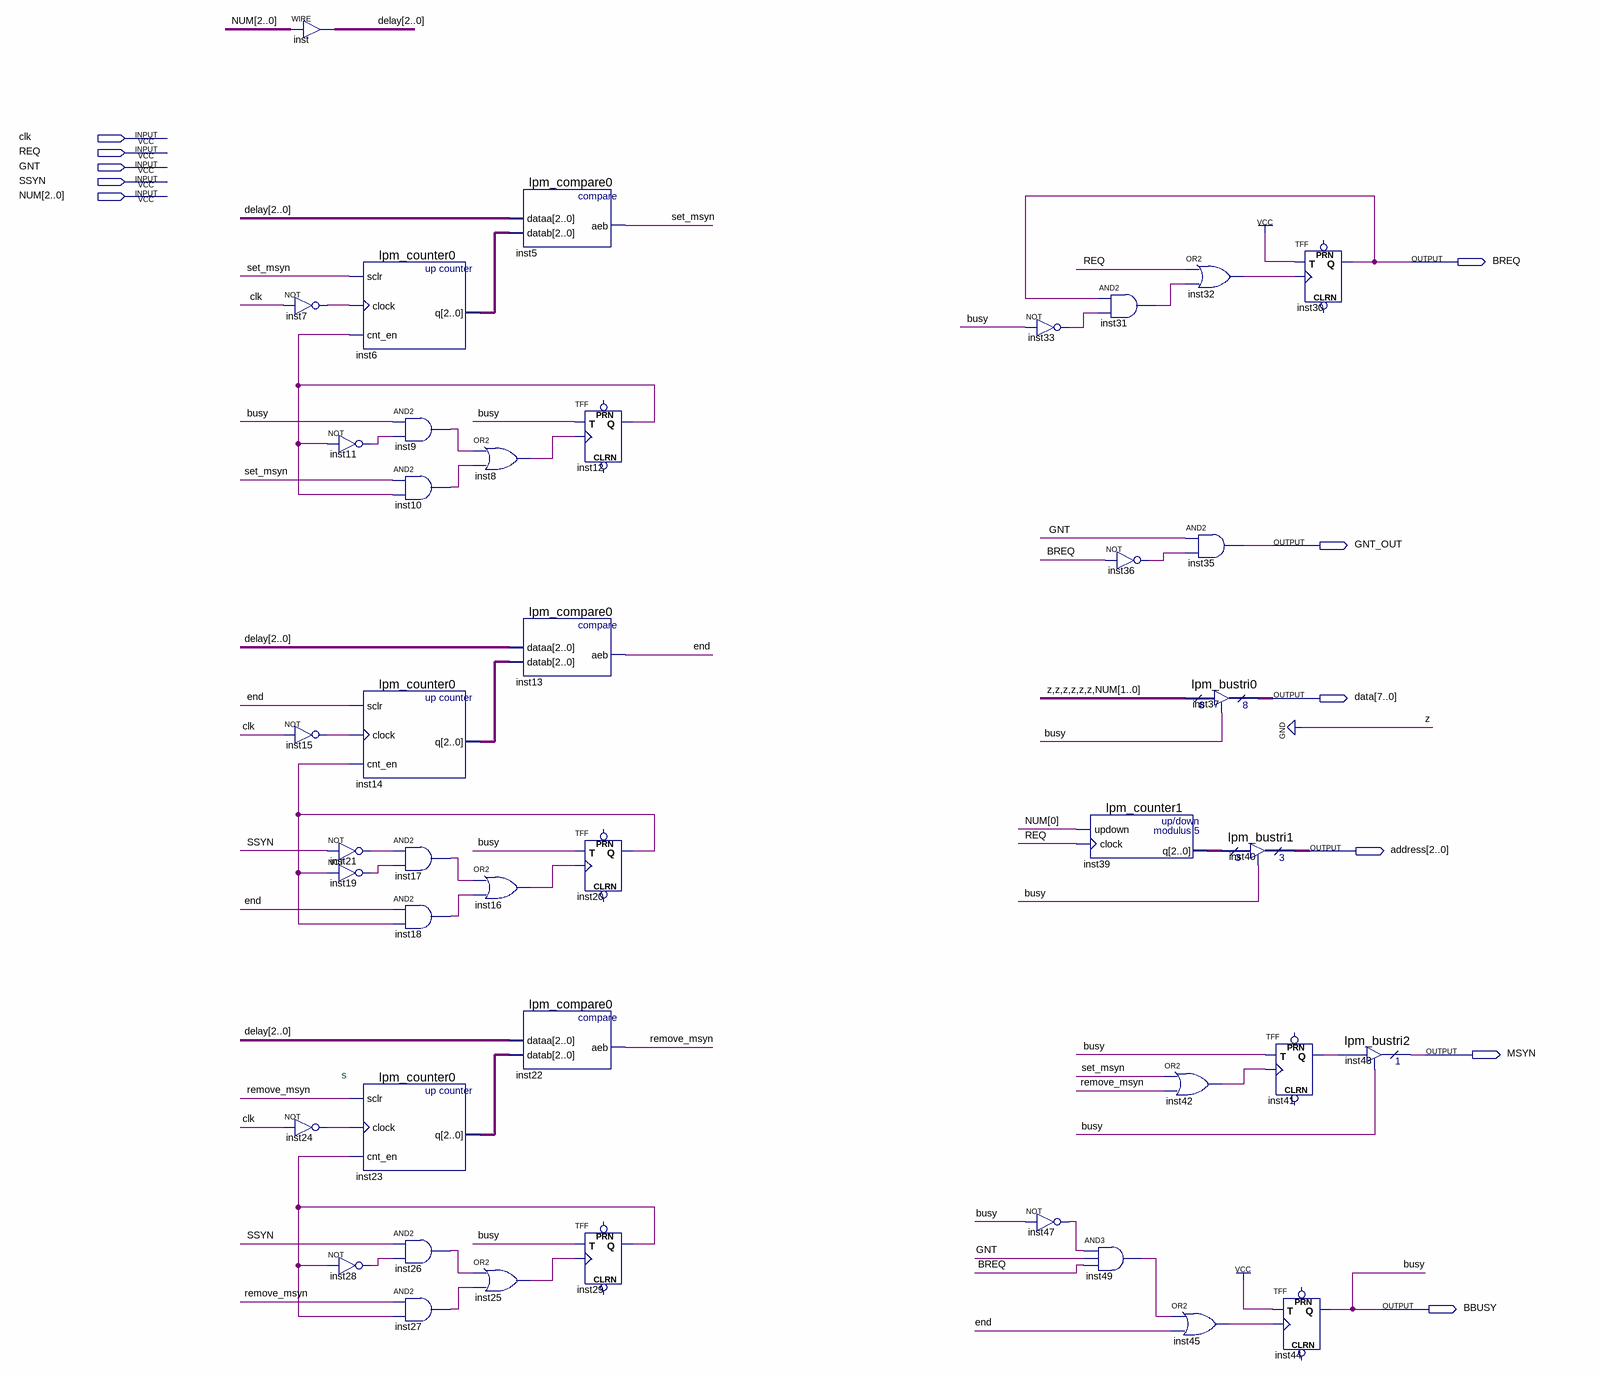
[diagram p0: schematic sheet]
// Quartus schematic master.bdf as structural Verilog: 42 symbols, 11 pins
module master (
  input  clk,
  input  REQ,
  input  GNT,
  input  SSYN,
  input  [2:0] NUM,
  output BREQ,
  output GNT_OUT,
  output [7:0] data,
  output [2:0] address,
  output MSYN,
  output BBUSY
);

  wire \end , inst7_out, inst8_out, inst9_out, inst10_out, inst11_out, inst12_q, inst15_out, inst16_out,
       inst17_out, inst18_out, inst19_out, inst20_q, inst21_out, inst24_out, inst25_out, inst26_out,
       inst27_out, inst28_out, inst29_q, inst31_out, inst32_out, inst33_out, inst36_out, inst41_q,
       inst42_out, inst45_out, inst47_out, inst49_out, remove_msyn, set_msyn;
  wire [2:0] delay, inst6_q, inst14_q, inst23_q, inst39_q;

  assign delay = NUM;  // WIRE inst
  not inst7 (inst7_out, clk);
  not inst15 (inst15_out, clk);
  not inst24 (inst24_out, clk);
  lpm_counter0 inst6 (.sclr(set_msyn), .clock(inst7_out), .cnt_en(inst12_q), .q(inst6_q));
  not inst11 (inst11_out, inst12_q);
  lpm_counter0 inst14 (.sclr(\end ), .clock(inst15_out), .cnt_en(inst20_q), .q(inst14_q));
  not inst21 (inst21_out, SSYN);
  not inst19 (inst19_out, inst20_q);
  lpm_counter0 inst23 (.sclr(remove_msyn), .clock(inst24_out), .cnt_en(inst29_q), .q(inst23_q));
  not inst28 (inst28_out, inst29_q);
  and inst9 (inst9_out, BBUSY, inst11_out);
  and inst10 (inst10_out, set_msyn, inst12_q);
  and inst17 (inst17_out, inst21_out, inst19_out);
  and inst18 (inst18_out, \end , inst20_q);
  and inst26 (inst26_out, SSYN, inst28_out);
  and inst27 (inst27_out, remove_msyn, inst29_q);
  or inst8 (inst8_out, inst9_out, inst10_out);
  or inst16 (inst16_out, inst17_out, inst18_out);
  or inst25 (inst25_out, inst26_out, inst27_out);
  lpm_compare0 inst5 (.dataa(delay), .datab(inst6_q), .aeb(set_msyn));
  lpm_compare0 inst13 (.dataa(delay), .datab(inst14_q), .aeb(\end ));
  lpm_compare0 inst22 (.dataa(delay), .datab(inst23_q), .aeb(remove_msyn));
  TFF inst12 (.T(BBUSY), .CLK(inst8_out), .Q(inst12_q));  // open: PRN, CLRN
  TFF inst20 (.T(BBUSY), .CLK(inst16_out), .Q(inst20_q));  // open: PRN, CLRN
  TFF inst29 (.T(BBUSY), .CLK(inst25_out), .Q(inst29_q));  // open: PRN, CLRN
  not inst33 (inst33_out, BBUSY);
  not inst47 (inst47_out, BBUSY);
  and inst31 (inst31_out, BREQ, inst33_out);
  not inst36 (inst36_out, BREQ);
  lpm_counter1 inst39 (.updown(NUM[0]), .clock(REQ), .q(inst39_q));
  and inst49 (inst49_out, inst47_out, GNT, BREQ);
  or inst42 (inst42_out, set_msyn, remove_msyn);
  or inst45 (inst45_out, inst49_out, \end );
  or inst32 (inst32_out, REQ, inst31_out);
  and inst35 (GNT_OUT, GNT, inst36_out);
  lpm_bustri0 inst37 (.enabledt(BBUSY), .data({{6{1'b0}}, NUM[1:0]}), .tridata(data));
  lpm_bustri1 inst40 (.enabledt(BBUSY), .data(inst39_q), .tridata(address));
  TFF inst41 (.T(BBUSY), .CLK(inst42_out), .Q(inst41_q));  // open: PRN, CLRN
  TFF inst44 (.T(1'b1), .CLK(inst45_out), .Q(BBUSY));  // open: PRN, CLRN
  TFF inst30 (.T(1'b1), .CLK(inst32_out), .Q(BREQ));  // open: PRN, CLRN
  lpm_bustri2 inst43 (.enabledt(BBUSY), .data(inst41_q), .tridata(MSYN));

  // Other names for the same wires on the sheet: busy = BBUSY

  // Notes on the sheet:
  //   s
endmodule
